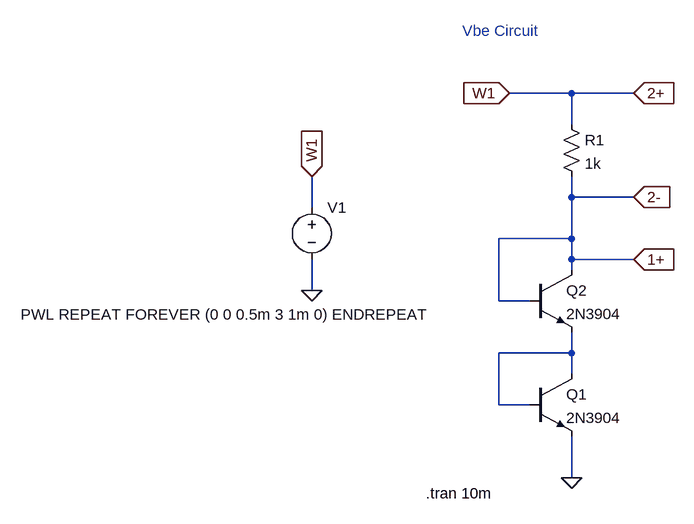
[diagram p0: schematic vbe_circuit1_ltspice.asc]
vbe_circuit1_ltspice.asc, the LTspice schematic file:
Version 4
SHEET 1 880 680
WIRE 64 -352 -32 -352
WIRE 160 -352 64 -352
WIRE 64 -304 64 -352
WIRE 64 -192 64 -224
WIRE 160 -192 64 -192
WIRE -336 -176 -336 -224
WIRE 64 -128 64 -192
WIRE 64 -128 -48 -128
WIRE 64 -96 64 -128
WIRE 160 -96 64 -96
WIRE 64 -80 64 -96
WIRE -336 -48 -336 -96
WIRE -48 -32 -48 -128
WIRE 0 -32 -48 -32
WIRE 64 48 64 16
WIRE 64 48 -48 48
WIRE 64 80 64 48
WIRE -48 128 -48 48
WIRE 0 128 -48 128
WIRE 64 240 64 176
FLAG -32 -352 W1
IOPIN -32 -352 In
FLAG -336 -48 0
FLAG -336 -224 W1
IOPIN -336 -224 In
FLAG 64 240 0
FLAG 160 -352 2+
IOPIN 160 -352 In
FLAG 160 -192 2-
IOPIN 160 -192 In
FLAG 160 -96 1+
IOPIN 160 -96 In
SYMBOL npn 0 80 R0
SYMATTR InstName Q1
SYMATTR Value 2N3904
SYMBOL res 48 -320 R0
SYMATTR InstName R1
SYMATTR Value 1k
SYMBOL voltage -336 -192 R0
WINDOW 3 -448 181 Left 2
WINDOW 123 0 0 Left 0
WINDOW 39 0 0 Left 0
SYMATTR Value PWL REPEAT FOREVER (0 0 0.5m 3 1m 0) ENDREPEAT
SYMATTR InstName V1
SYMBOL npn 0 -80 R0
SYMATTR InstName Q2
SYMATTR Value 2N3904
TEXT -160 264 Left 2 !.tran 10m
TEXT -104 -448 Left 2 ;Vbe Circuit

The netlist it stands for:
* vbe_circuit1_ltspice.asc
Q1 N001 N001 0 0 2N3904
R1 2+ 1+ 1k
V1 2+ 0 PWL REPEAT FOREVER (0 0 0.5m 3 1m 0) ENDREPEAT
Q2 1+ 1+ N001 0 2N3904
.model NPN NPN
.model PNP PNP
.lib standard.bjt
.tran 10m
* Vbe Circuit
.backanno
.end